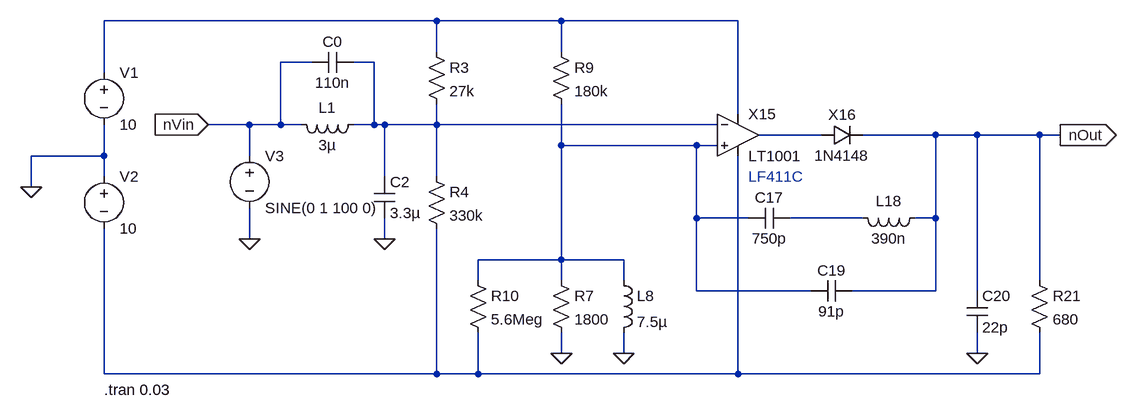
[diagram p0: schematic 71969188.asc]
71969188.asc, the LTspice schematic file:
Version 4
SHEET 1 1316 680
WIRE 144 -96 -368 -96
WIRE 336 -96 144 -96
WIRE 608 -96 336 -96
WIRE 144 -48 144 -96
WIRE 336 -48 336 -96
WIRE -48 -32 -96 -32
WIRE 48 -32 16 -32
WIRE -368 -16 -368 -96
WIRE 608 48 608 -96
WIRE -144 64 -208 64
WIRE -96 64 -96 -32
WIRE -96 64 -144 64
WIRE -64 64 -96 64
WIRE 48 64 48 -32
WIRE 48 64 16 64
WIRE 64 64 48 64
WIRE 144 64 144 32
WIRE 144 64 64 64
WIRE 576 64 144 64
WIRE 736 80 640 80
WIRE 912 80 800 80
WIRE 976 80 912 80
WIRE 1072 80 976 80
WIRE 1104 80 1072 80
WIRE 336 96 336 32
WIRE 544 96 336 96
WIRE 576 96 544 96
WIRE -368 112 -368 64
WIRE -368 112 -480 112
WIRE -144 112 -144 64
WIRE -368 144 -368 112
WIRE 64 144 64 64
WIRE 144 144 144 64
WIRE -480 160 -480 112
WIRE 544 208 544 96
WIRE 624 208 544 208
WIRE 800 208 688 208
WIRE 912 208 912 80
WIRE 912 208 880 208
WIRE -144 240 -144 192
WIRE 64 240 64 208
WIRE 336 272 336 96
WIRE 336 272 208 272
WIRE 432 272 336 272
WIRE 208 304 208 272
WIRE 336 304 336 272
WIRE 432 304 432 272
WIRE 1072 304 1072 80
WIRE 544 320 544 208
WIRE 720 320 544 320
WIRE 912 320 912 208
WIRE 912 320 784 320
WIRE 976 320 976 80
WIRE 336 416 336 384
WIRE 432 416 432 384
WIRE 976 416 976 384
WIRE -368 448 -368 224
WIRE 144 448 144 224
WIRE 144 448 -368 448
WIRE 208 448 208 384
WIRE 208 448 144 448
WIRE 608 448 608 112
WIRE 608 448 208 448
WIRE 1072 448 1072 384
WIRE 1072 448 608 448
FLAG -480 160 0
FLAG -208 64 nVin
IOPIN -208 64 In
FLAG 1104 80 nOut
IOPIN 1104 80 Out
FLAG -144 240 0
FLAG 64 240 0
FLAG 976 416 0
FLAG 336 416 0
FLAG 432 416 0
SYMBOL ind 32 48 R90
WINDOW 0 5 56 VBottom 2
WINDOW 3 32 56 VTop 2
SYMATTR InstName L1
SYMATTR Value 3µ
SYMBOL voltage -368 -32 R0
WINDOW 123 0 0 Left 0
WINDOW 39 0 0 Left 0
SYMATTR InstName V1
SYMATTR Value 10
SYMBOL voltage -368 128 R0
WINDOW 123 0 0 Left 0
WINDOW 39 0 0 Left 0
SYMATTR InstName V2
SYMATTR Value 10
SYMBOL Opamps\\LT1001 608 16 R0
SYMATTR InstName X15
SYMBOL voltage -144 96 R0
WINDOW 123 0 0 Left 0
WINDOW 39 0 0 Left 0
SYMATTR InstName V3
SYMATTR Value SINE(0 1 100 0)
SYMBOL res 128 -64 R0
SYMATTR InstName R3
SYMATTR Value 27k
SYMBOL res 128 128 R0
SYMATTR InstName R4
SYMATTR Value 330k
SYMBOL cap 16 -48 R90
WINDOW 0 0 32 VBottom 2
WINDOW 3 32 32 VTop 2
SYMATTR InstName C0
SYMATTR Value 110n
SYMBOL cap 48 144 R0
SYMATTR InstName C2
SYMATTR Value 3.3µ
SYMBOL cap 688 192 R90
WINDOW 0 0 32 VBottom 2
WINDOW 3 32 32 VTop 2
SYMATTR InstName C17
SYMATTR Value 750p
SYMBOL ind 896 192 R90
WINDOW 0 5 56 VBottom 2
WINDOW 3 32 56 VTop 2
SYMATTR InstName L18
SYMATTR Value 390n
SYMBOL diode 736 96 R270
WINDOW 0 32 32 VTop 2
WINDOW 3 0 32 VBottom 2
SYMATTR InstName X16
SYMATTR Value 1N4148
SYMBOL cap 784 304 R90
WINDOW 0 0 32 VBottom 2
WINDOW 3 32 32 VTop 2
SYMATTR InstName C19
SYMATTR Value 91p
SYMBOL cap 960 320 R0
SYMATTR InstName C20
SYMATTR Value 22p
SYMBOL res 1056 288 R0
SYMATTR InstName R21
SYMATTR Value 680
SYMBOL res 320 288 R0
SYMATTR InstName R7
SYMATTR Value 1800
SYMBOL ind 416 288 R0
SYMATTR InstName L8
SYMATTR Value 7.5µ
SYMBOL res 320 -64 R0
SYMATTR InstName R9
SYMATTR Value 180k
SYMBOL res 192 288 R0
SYMATTR InstName R10
SYMATTR Value 5.6Meg
TEXT -368 472 Left 2 !.tran 0.03
TEXT 624 144 Left 2 ;LF411C

The netlist it stands for:
* 71969188.asc
L1 N002 nVin 3µ
V1 N001 0 10
V2 0 N006 10
XX15 N004 N002 N001 N006 N003 LT1001  ; pins In+ In- V+ V- OUT
V3 nVin 0 SINE(0 1 100 0)
R3 N001 N002 27k
R4 N002 N006 330k
C0 N002 nVin 110n
C2 N002 0 3.3µ
C17 N005 N004 750p
L18 nOut N005 390n
D§X16 N003 nOut 1N4148
C19 nOut N004 91p
C20 nOut 0 22p
R21 nOut N006 680
R7 N004 0 1800
L8 N004 0 7.5µ
R9 N001 N004 180k
R10 N004 N006 5.6Meg
.model D D
.lib standard.dio
.tran 0.03
* LF411C
.lib LTC.lib
.backanno
.end